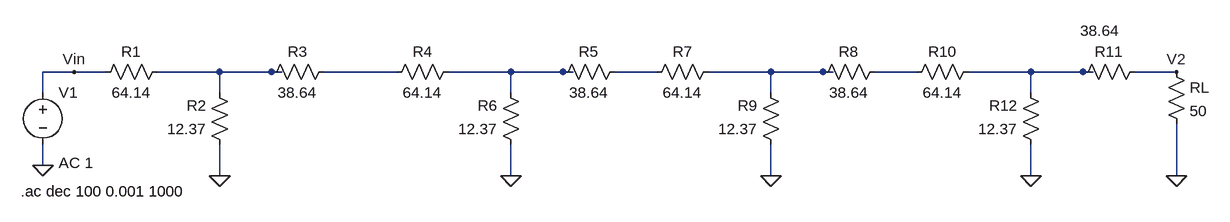
[diagram p0: schematic Simu.asc]
Simu.asc, the LTspice schematic file:
Version 4
SHEET 1 1748 680
WIRE 0 144 -48 144
WIRE 48 144 0 144
WIRE 224 144 128 144
WIRE 304 144 224 144
WIRE 320 144 304 144
WIRE 496 144 384 144
WIRE 672 144 576 144
WIRE 752 144 672 144
WIRE 768 144 752 144
WIRE 896 144 832 144
WIRE 1072 144 976 144
WIRE 1152 144 1072 144
WIRE 1168 144 1152 144
WIRE 1296 144 1232 144
WIRE 1472 144 1376 144
WIRE 1552 144 1472 144
WIRE 1568 144 1552 144
WIRE 1696 144 1632 144
WIRE -48 176 -48 144
WIRE 224 176 224 144
WIRE 672 176 672 144
WIRE 1072 176 1072 144
WIRE 1472 176 1472 144
WIRE -48 288 -48 256
WIRE 224 304 224 256
WIRE 672 304 672 256
WIRE 1072 304 1072 256
WIRE 1472 304 1472 256
WIRE 1696 304 1696 224
FLAG 224 304 0
FLAG 0 144 Vin
FLAG -48 288 0
FLAG 1696 304 0
FLAG 672 304 0
FLAG 1072 304 0
FLAG 1472 304 0
FLAG 1696 144 V2
SYMBOL res 144 128 R90
WINDOW 0 0 56 VBottom 2
WINDOW 3 32 56 VTop 2
SYMATTR InstName R1
SYMATTR Value 64.14
SYMBOL res 400 128 R90
WINDOW 0 0 56 VBottom 2
WINDOW 3 32 56 VTop 2
SYMATTR InstName R3
SYMATTR Value 38.64
SYMBOL res 240 272 R180
WINDOW 0 36 76 Left 2
WINDOW 3 36 40 Left 2
SYMATTR InstName R2
SYMATTR Value 12.37
SYMBOL res 1680 128 R0
SYMATTR InstName RL
SYMATTR Value 50
SYMBOL voltage -48 160 R0
WINDOW 123 24 124 Left 2
WINDOW 39 0 0 Left 0
SYMATTR InstName V1
SYMATTR Value ""
SYMATTR Value2 AC 1
SYMBOL res 592 128 R90
WINDOW 0 0 56 VBottom 2
WINDOW 3 32 56 VTop 2
SYMATTR InstName R4
SYMATTR Value 64.14
SYMBOL res 848 128 R90
WINDOW 0 0 56 VBottom 2
WINDOW 3 32 56 VTop 2
SYMATTR InstName R5
SYMATTR Value 38.64
SYMBOL res 688 272 R180
WINDOW 0 36 76 Left 2
WINDOW 3 36 40 Left 2
SYMATTR InstName R6
SYMATTR Value 12.37
SYMBOL res 992 128 R90
WINDOW 0 0 56 VBottom 2
WINDOW 3 32 56 VTop 2
SYMATTR InstName R7
SYMATTR Value 64.14
SYMBOL res 1248 128 R90
WINDOW 0 0 56 VBottom 2
WINDOW 3 32 56 VTop 2
SYMATTR InstName R8
SYMATTR Value 38.64
SYMBOL res 1088 272 R180
WINDOW 0 36 76 Left 2
WINDOW 3 36 40 Left 2
SYMATTR InstName R9
SYMATTR Value 12.37
SYMBOL res 1392 128 R90
WINDOW 0 0 56 VBottom 2
WINDOW 3 32 56 VTop 2
SYMATTR InstName R10
SYMATTR Value 64.14
SYMBOL res 1648 128 R90
WINDOW 0 0 56 VBottom 2
WINDOW 3 -63 70 VTop 2
SYMATTR InstName R11
SYMATTR Value 38.64
SYMBOL res 1488 272 R180
WINDOW 0 36 76 Left 2
WINDOW 3 36 40 Left 2
SYMATTR InstName R12
SYMATTR Value 12.37
TEXT -82 328 Left 2 !.ac dec 100 0.001 1000

The netlist it stands for:
* Simu.asc
R1 N001 Vin 64.14
R3 N002 N001 38.64
R2 0 N001 12.37
RL V2 0 50
V1 Vin 0 AC 1
R4 N003 N002 64.14
R5 N004 N003 38.64
R6 0 N003 12.37
R7 N005 N004 64.14
R8 N006 N005 38.64
R9 0 N005 12.37
R10 N007 N006 64.14
R11 V2 N007 38.64
R12 0 N007 12.37
.ac dec 100 0.001 1000
.backanno
.end